# Altium schematic sheet LV_BUCK.SchDoc (part 3 of 3)
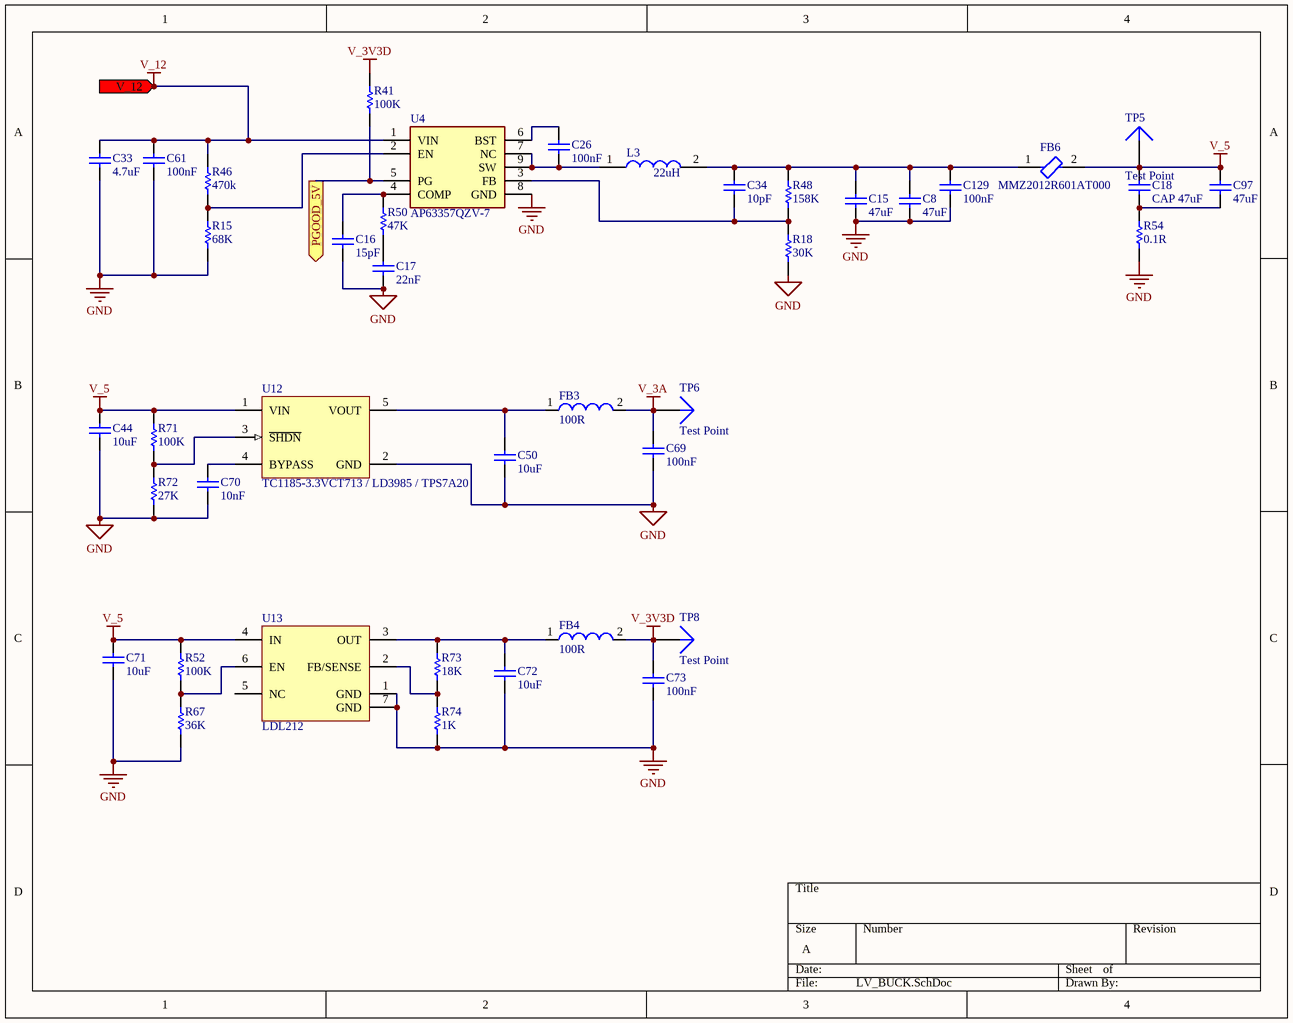
[diagram p2: LV_BUCK.SchDoc]

## Library data of the parts (continued)
R72 = CMP-2100-03662-1: ±1% ±100ppm/℃ 0.1W 27kΩ 0603 Chip Resistor - Surface Mount ROHS; Manufacturer: Yageo; Manufacturer Part Number: RC0603FR-07100KL; Power Rating: 100mW; Voltage Rating: 50V; Resistance: 100KOhm; Temperature Coefficient: 100ppm/degreesC; Working Voltage: 75V; Datasheet Version: Rev. 5, 10/2016; Height: 0.45mm; Lead Free: LeadFree; Manufacturer URL: http://www.yageo.com/; Package Reference: 0603; Depth: 0.8mm; RoHSCompliant: true; Composition: ThickFilm; Military Standard: Not; Case/Package: 0603; Packaging: TapeandReel; Case Code (Imperial): 0603; Voltage Rating (DC): 50V; Case Code (Metric): 1608; Tolerance: 1%; Termination: SMD/SMT; Min Operating Temperature: -55degC; Number of Pins: 2; Length: 1.6mm; Width: 0.8mm; Datasheet URL: http://www.yageo.com/NewPortal/yageodocoutput?fileName=/pdf/R-Chip/PYu-RC_Group_51_RoHS_L_5.pdf; Package Description: 2-Pin Surface Mount Device, Body 1.6 x 0.8 mm; Max Operating Temperature: 155degC; REACH SVHC: NoSVHC; Supplier 1: Digi-Key; Supplier Part Number 1: 311-100KHRCT-ND; RoHS: Yes; Category: Chip SMD Resistors; Stock 1: 19283456; Pricing 1: 1=0.10000, 10=0.02400, 100=0.00970, 1000=0.00436, 2500=0.00378 (USD); Series: RC; Max Power Dissipation: 100mW; Resistor Type: Thick Film; Number of Terminations: 2; Resistance Tolerance: 1%; Features: Moisture Resistant; Construction: Rectangular; Technology: THICK FILM; RoHS Compliant: Yes; ComponentLink1URL: https://datasheet.ciiva.com/11808/0900766b80f96399-11808107.pdf?src-supplier=RSComponents; ComponentLink1Description: https://datasheet.ciiva.com/11808/0900766b80f96399-11808107.pdf?src-supplier=RSComponents; ComponentLink2URL: https://datasheet.ciiva.com/7983/443971-7983593.pdf?src-supplier=Element14; ComponentLink2Description: https://datasheet.ciiva.com/7983/443971-7983593.pdf?src-supplier=Element14; ComponentLink3URL: https://datasheet.ciiva.com/46440/1868787-46440889.pdf?src-supplier=Element14; ComponentLink3Description: https://datasheet.ciiva.com/46440/1868787-46440889.pdf?src-supplier=Element14; ComponentLink4URL: https://datasheet.ciiva.com/7746/1738695-7746234.pdf?src-supplier=Element14; ComponentLink4Description: https://datasheet.ciiva.com/7746/1738695-7746234.pdf?src-supplier=Element14; ComponentLink5URL: https://datasheet.ciiva.com/7746/1738695-7746235.pdf?src-supplier=Element14; ComponentLink5Description: https://datasheet.ciiva.com/7746/1738695-7746235.pdf?src-supplier=Element14; ComponentLink6URL: https://datasheet.ciiva.com/22747/443971-22747516.pdf?src-supplier=Element14; ComponentLink6Description: https://datasheet.ciiva.com/22747/443971-22747516.pdf?src-supplier=Element14; Parameter 1: *; JLCPCB Part #: C22967
R73 = CMP-2000-00938-1: 18kΩ ±1% ±100ppm/℃ 0.1W 0603 Chip Resistor - Surface Mount ROHS; Manufacturer: Panasonic; Part Number: ERA3AEB183V; Manufacturer Part Number: ERA-3AEB183V; Resistance: 18kR; Power Rating: 100mW; Tolerance: 0.1%; Temperature Coefficient: 25ppm/°C; Voltage Rating (DC): 75V; Supplier 1: Newark; Supplier Part Number 1: 08N2107; RoHS: Yes; Category: Chip SMD Resistors; Stock 1: 2207; Pricing 1: 1=0.35700, 25=0.30700, 50=0.21600, 100=0.12400, 250=0.10000, 500=0.07500, 1000=0.05100 (USD); Mount: Surface Mount; Case/Package: 0603; Number of Pins: 2; Case Code (Metric): 1608; Case Code (Imperial): 0603; Contact Plating: Tin; Size Code: 0603; Min Operating Temperature: -55°C; Max Operating Temperature: 155°C; Packaging: Tape and Reel; Resistor Type: Thin Film; Number of Terminations: 2; Max Power Dissipation: 100mW; Series: ERA-3A; Voltage Rating: 75V; Package Quantity: 1; Termination: SMD/SMT; Features: Automotive AEC-Q200; Resistance Tolerance: 0.1%; Construction: Rectangular; Technology: METAL FILM; Length: 1.6mm; Width: 0.8mm; Height: 0.45mm; Depth: 0.8mm; Radiation Hardening: No; RoHS Compliant: Yes; Lead Free: Lead Free; REACH SVHC: No SVHC; Military Standard: Not; ComponentLink1URL: https://datasheet.ciiva.com/11808/0900766b80fe20f7-11808020.pdf?src-supplier=RSComponents; ComponentLink1Description: https://datasheet.ciiva.com/11808/0900766b80fe20f7-11808020.pdf?src-supplier=RSComponents; ComponentLink2URL: https://datasheet.ciiva.com/29183/451333-da-01-en-widerstand-0603-era-29183823.pdf?src-supplier=Conrad; ComponentLink2Description: https://datasheet.ciiva.com/29183/451333-da-01-en-widerstand-0603-era-29183823.pdf?src-supplier=Conrad; ComponentLink3URL: https://datasheet.ciiva.com/16395/aoa0000ce26-16395253.pdf?src-supplier=Future+Electronics; ComponentLink3Description: https://datasheet.ciiva.com/16395/aoa0000ce26-16395253.pdf?src-supplier=Future+Electronics; ComponentLink4URL: https://datasheet.ciiva.com/16764/70068849-16764837.pdf?src-supplier=Allied+Electronics; ComponentLink4Description: https://datasheet.ciiva.com/16764/70068849-16764837.pdf?src-supplier=Allied+Electronics; ComponentLink5URL: https://datasheet.ciiva.com/9117/aoa0000ce26-9117398.pdf?src-supplier=Avnet; ComponentLink5Description: https://datasheet.ciiva.com/9117/aoa0000ce26-9117398.pdf?src-supplier=Avnet; ComponentLink6URL: https://datasheet.ciiva.com/17211/aoa0000ce26-17211238.pdf?src-supplier=Avnet+Europe; ComponentLink6Description: https://datasheet.ciiva.com/17211/aoa0000ce26-17211238.pdf?src-supplier=Avnet+Europe; ComponentLink7URL: https://datasheet.ciiva.com/22739/485442-22739288.pdf?src-supplier=Element14; ComponentLink7Description: https://datasheet.ciiva.com/22739/485442-22739288.pdf?src-supplier=Element14; ComponentLink8URL: https://datasheet.ciiva.com/48425/era-eng-tds-48425433.pdf?src-supplier=Distrelec; ComponentLink8Description: https://datasheet.ciiva.com/48425/era-eng-tds-48425433.pdf?src-supplier=Distrelec; ComponentLink9URL: https://datasheet.ciiva.com/48530/era-eng-tds-48530218.pdf?src-supplier=Distrelec; ComponentLink9Description: https://datasheet.ciiva.com/48530/era-eng-tds-48530218.pdf?src-supplier=Distrelec; ComponentLink10URL: https://datasheet.ciiva.com/5860/485442-5860507.pdf?src-supplier=Farnell; ComponentLink10Description: https://datasheet.ciiva.com/5860/485442-5860507.pdf?src-supplier=Farnell; ComponentLink11URL: https://datasheet.ciiva.com/16771/70068849-16771099.pdf?src-supplier=Allied+Electronics; ComponentLink11Description: https://datasheet.ciiva.com/16771/70068849-16771099.pdf?src-supplier=Allied+Electronics; ComponentLink12URL: https://datasheet.ciiva.com/5860/485442-5860508.pdf?src-supplier=Farnell; ComponentLink12Description: https://datasheet.ciiva.com/5860/485442-5860508.pdf?src-supplier=Farnell; ComponentLink13URL: https://datasheet.ciiva.com/7944/485442-7944492.pdf?src-supplier=Element14; ComponentLink13Description: https://datasheet.ciiva.com/7944/485442-7944492.pdf?src-supplier=Element14; ComponentLink14URL: https://datasheet.ciiva.com/30234/54aoa0000ce26-30234638.pdf?src-supplier=Onlinecomponents.com; ComponentLink14Description: https://datasheet.ciiva.com/30234/54aoa0000ce26-30234638.pdf?src-supplier=Onlinecomponents.com; ComponentLink15URL: https://datasheet.ciiva.com/46422/485442-46422590.pdf?src-supplier=Element14; ComponentLink15Description: https://datasheet.ciiva.com/46422/485442-46422590.pdf?src-supplier=Element14; ComponentLink16URL: https://datasheet.ciiva.com/46422/485442-46422591.pdf?src-supplier=Element14; ComponentLink16Description: https://datasheet.ciiva.com/46422/485442-46422591.pdf?src-supplier=Element14; Parameter 1: *; JLCPCB Part #: C25810
R74 = CMP-2000-00180-1: ±1% ±100ppm/℃ 1kΩ 0.1W 0603 Chip Resistor - Surface Mount ROHS; Part Number: ERJ-3EKF1001V; Manufacturer: Panasonic; Manufacturer Part Number: ERJ3EKF1001V; Resistance: 1kR; Power Rating: 100mW; Voltage Rating: 75V; Temperature Coefficient: 100ppm/°C; Supplier 1: Future Electronics; Supplier Part Number 1: 3028514; RoHS: Yes; Category: Chip SMD Resistors; Stock 1: 430000; Pricing 1: 5000=0.01860, 10000=0.01510, 15000=0.01500, 20000=0.01490 (USD); Mount: Surface Mount; Case/Package: 0603; Number of Pins: 2; Case Code (Metric): 1608; Case Code (Imperial): 0603; Contact Plating: Tin; Size Code: 0603; Min Operating Temperature: -55°C; Max Operating Temperature: 155°C; Packaging: Tape and Reel; Tolerance: 1%; Termination: SMD/SMT; Package Quantity: 5000; Series: ERJ; Resistor Type: Thick Film; Max Power Dissipation: 100mW; Construction: Rectangular; Resistance Tolerance: 1%; Number of Terminations: 2; Features: Automotive AEC-Q200; Voltage Rating (DC): 75V; Technology: THICK FILM; Length: 1.6mm; Width: 0.8mm; Height: 0.45mm; Depth: 0.8mm; Radiation Hardening: No; REACH SVHC: No SVHC; Lead Free: Lead Free; RoHS Compliant: Yes; Military Standard: Not; ComponentLink1URL: https://datasheet.ciiva.com/16768/70260748-16768437.pdf?src-supplier=Allied+Electronics; ComponentLink1Description: https://datasheet.ciiva.com/16768/70260748-16768437.pdf?src-supplier=Allied+Electronics; ComponentLink2URL: https://datasheet.ciiva.com/16774/70260748-16774550.pdf?src-supplier=Allied+Electronics; ComponentLink2Description: https://datasheet.ciiva.com/16774/70260748-16774550.pdf?src-supplier=Allied+Electronics; ComponentLink3URL: https://datasheet.ciiva.com/16449/aoa0000ce2-16449065.pdf?src-supplier=Future+Electronics; ComponentLink3Description: https://datasheet.ciiva.com/16449/aoa0000ce2-16449065.pdf?src-supplier=Future+Electronics; ComponentLink4URL: https://datasheet.ciiva.com/7942/aoa0000ce2-7942427.pdf?src-supplier=Element14; ComponentLink4Description: https://datasheet.ciiva.com/7942/aoa0000ce2-7942427.pdf?src-supplier=Element14; ComponentLink5URL: https://datasheet.ciiva.com/9198/aoa0000ce2-9198923.pdf?src-supplier=Avnet; ComponentLink5Description: https://datasheet.ciiva.com/9198/aoa0000ce2-9198923.pdf?src-supplier=Avnet; ComponentLink6URL: https://datasheet.ciiva.com/46373/1678782-46373339.pdf?src-supplier=Element14; ComponentLink6Description: https://datasheet.ciiva.com/46373/1678782-46373339.pdf?src-supplier=Element14; ComponentLink7URL: https://datasheet.ciiva.com/48530/aoa0000ce2-48530987.pdf?src-supplier=Avnet; ComponentLink7Description: https://datasheet.ciiva.com/48530/aoa0000ce2-48530987.pdf?src-supplier=Avnet; ComponentLink8URL: https://datasheet.ciiva.com/46373/1678782-46373340.pdf?src-supplier=Element14; ComponentLink8Description: https://datasheet.ciiva.com/46373/1678782-46373340.pdf?src-supplier=Element14; ComponentLink9URL: https://datasheet.ciiva.com/24070/aoa0000ce2-24070269.pdf?src-supplier=Mouser; ComponentLink9Description: https://datasheet.ciiva.com/24070/aoa0000ce2-24070269.pdf?src-supplier=Mouser; ComponentLink10URL: https://datasheet.ciiva.com/22673/1678782-22673918.pdf?src-supplier=Element14; ComponentLink10Description: https://datasheet.ciiva.com/22673/1678782-22673918.pdf?src-supplier=Element14; ComponentLink11URL: https://datasheet.ciiva.com/30063/aoa0000ce2-30063390.pdf?src-supplier=Onlinecomponents.com; ComponentLink11Description: https://datasheet.ciiva.com/30063/aoa0000ce2-30063390.pdf?src-supplier=Onlinecomponents.com; ComponentLink12URL: https://datasheet.ciiva.com/17215/aoa0000ce2-17215311.pdf?src-supplier=Avnet+Europe; ComponentLink12Description: https://datasheet.ciiva.com/17215/aoa0000ce2-17215311.pdf?src-supplier=Avnet+Europe; Parameter 1: *; JLCPCB Part #: C21190
TP5 TP6 TP8 = Test_Point 1.5mm round: Round Test Point; LatestRevisionDate: 17-Jul-2002; LatestRevisionNote: Re-released for DXP Platform.; Publisher: Altium Limited; Parameter 1: *; JLCPCB Part #: *
U4 = AP63357QZV-7: Integrated Circuit; Manufacturer_Name: Diodes Inc.; Datasheet Link: https://www.diodes.com/assets/Datasheets/AP63356Q_AP63357Q.pdf; Height: 0.85mm; Manufacturer_Part_Number: AP63357QZV-7; Mouser Part Number: 621-AP63357QZV-7; Mouser Price/Stock: https://www.mouser.co.uk/ProductDetail/Diodes-Incorporated/AP63357QZV-7?qs=DPoM0jnrROUeS%2FU8ZrDy%2FA%3D%3D; Parameter 1: *; JLCPCB Part #: *
U12 = PM-LINEREG-TC1014-IL5: 50 mA, 100 mA and 150 mA CMOS LDOs with Active-Low Shutdown and Reference Bypass, 5-Pin SOT-23, Extended Temperature, Tape and Reel; PackageVersion: revBB, Aug-2009; Code_IPC: SOT23-5; PackageDescription: 5-Lead Plastic Small Outline Transistor (CT) [SOT-23]; DatasheetVersion: revE, Feb-2007; PackageReference: SOT-23-CT5; Parameter 1: *; JLCPCB Part #: *
U13 = LDL212: Parameter 1: *; JLCPCB Part #: *